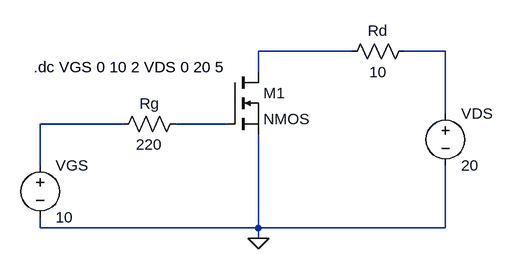
[diagram p0: schematic MOSFET (2).asc]
MOSFET (2).asc, the LTspice schematic file:
Version 4
SHEET 1 880 680
WIRE 432 -16 288 -16
WIRE 576 -16 512 -16
WIRE 288 16 288 -16
WIRE 576 80 576 -16
WIRE 80 96 -48 96
WIRE 240 96 160 96
WIRE -48 160 -48 96
WIRE -48 256 -48 240
WIRE 288 256 288 112
WIRE 288 256 -48 256
WIRE 576 256 576 160
WIRE 576 256 288 256
WIRE 288 272 288 256
FLAG 288 272 0
SYMBOL voltage -48 144 R0
SYMATTR InstName VGS
SYMATTR Value 10
SYMBOL voltage 576 64 R0
SYMATTR InstName VDS
SYMATTR Value 20
SYMBOL res 176 80 R90
WINDOW 0 0 56 VBottom 2
WINDOW 3 32 56 VTop 2
SYMATTR InstName Rg
SYMATTR Value 220
SYMBOL nmos 240 16 R0
SYMATTR InstName M1
SYMBOL res 528 -32 R90
WINDOW 0 0 56 VBottom 2
WINDOW 3 32 56 VTop 2
SYMATTR InstName Rd
SYMATTR Value 10
TEXT -58 8 Left 2 !.dc VGS 0 10 2 VDS 0 20 5

The netlist it stands for:
* MOSFET (2).asc
VGS N003 0 10
VDS N002 0 20
Rg N004 N003 220
M1 N001 N004 0 0 NMOS
Rd N002 N001 10
.model NMOS NMOS
.model PMOS PMOS
.lib standard.mos
.dc VGS 0 10 2 VDS 0 20 5
.backanno
.end